# EAGLE design V0p2_Main_PCB2 (EAGLE 6.5.0)
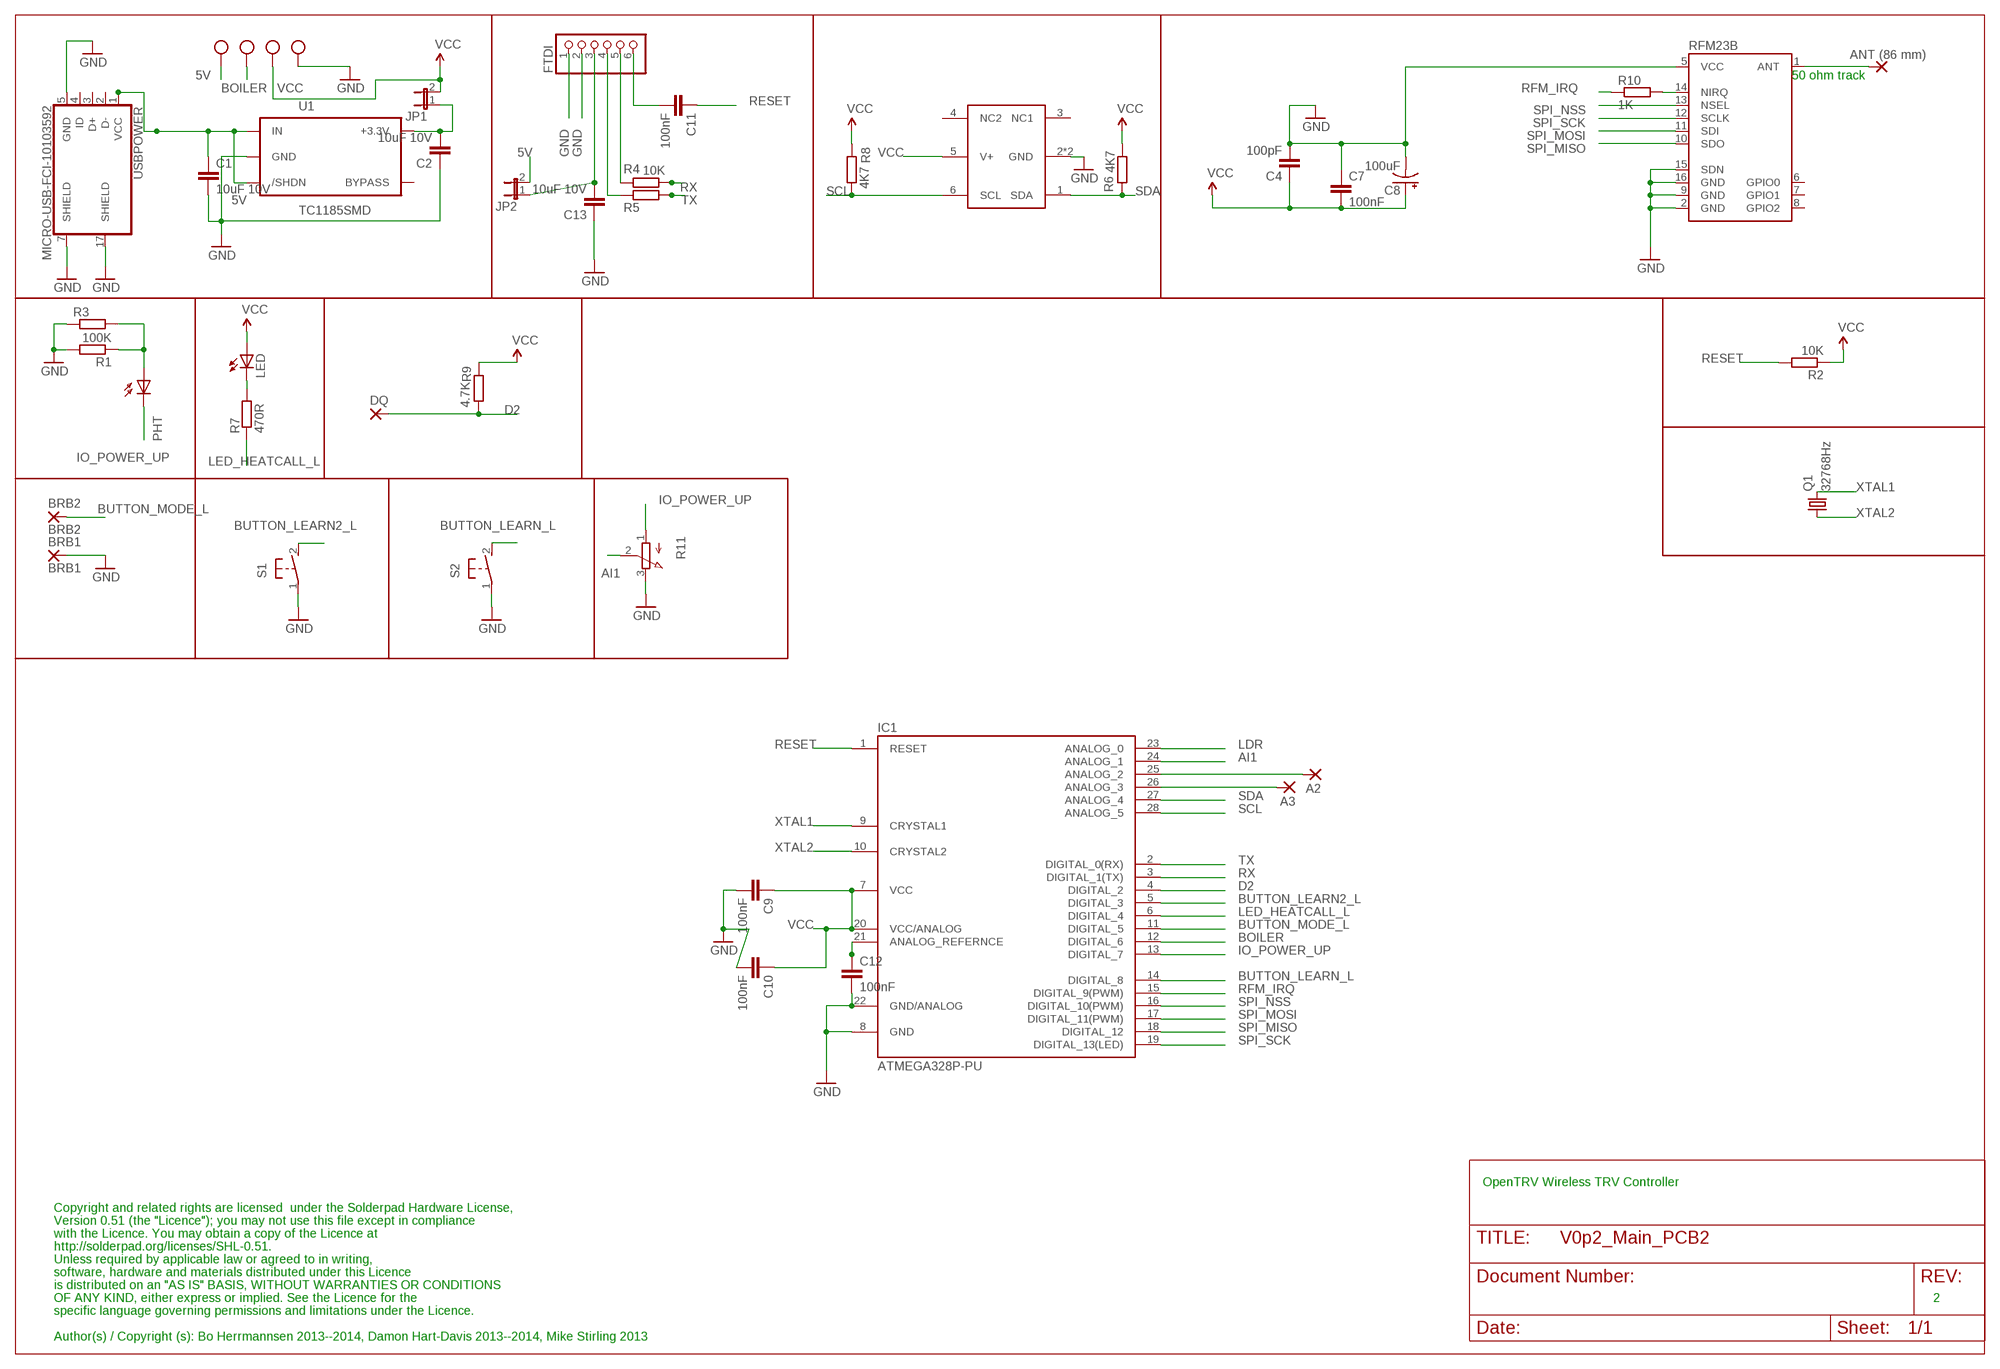
[diagram p0: schematic, sheet 1]

## Parts
A2  2,15/1,0  [2,15/1,0]
A3  2,15/1,0  [2,15/1,0]
ANT1  ANT (86 mm)  2,15/1,0  [2,15/1,0]
BRB1  BRB1  2,15/1,0  [2,15/1,0]
BRB2  BRB2  2,15/1,0  [2,15/1,0]
C1  10uF 10V  C-EUC0603  [C0603]
C2  10uF 10V  C-EUC0603  [C0603]
C4  100pF  C-EUC0603  [C0603]
C7  100nF  C-EUC0603  [C0603]
C8  100uF  CAP_POL1206  [EIA3216]
C9  100nF  C-EUC0603  [C0603]
C10  100nF  C-EUC0603  [C0603]
C11  100nF  C-EUC0603  [C0603]
C12  100nF  C-EUC0603  [C0603]
C13  10uF 10V  C-EUC0603  [C0603]
DQ  2,15/1,0  [2,15/1,0]
FTDI  PINHD-1X6/90  [1X06/90]
IC1  ATMEGA328P-PU  ATMEGA8-PU  [DIL28-3]
JP1  JP1E  [JP1]
JP2  JP1E  [JP1]
LED  LED3MM  [LED3MM]
PHT  BPX65  [BPX65]
Q1  32768Hz  MC-306  [MC-306]
R1  100K  R-EU_R0603  [R0603]
R2  10K  R-EU_R0603  [R0603]
R3  R-EU_0309/V  [0309V]
R4  10K  R-EU_R0603  [R0603]
R5  10K  R-EU_R0603  [R0603]
R6  4K7  R-EU_R0603  [R0603]
R7  470R  R-EU_R0603  [R0603]
R8  4K7  R-EU_R0603  [R0603]
R9  4.7K  R-EU_R0603  [R0603]
R10  1K  R-EU_R0603  [R0603]
R11  EVUE2A  [EVUE]
RFM23B  RFM23B  [RFM23-XXX-S1]
S1  31-XX  [B3F-31XX]
S2  31-XX  [B3F-31XX]
U1  TC1185SMD  [TC1185]
U$4  SHT21  [SHT21]
USBPOWER  MICRO-USB-FCI-10103592  [MICRO-USB-FCI-10103592]
X1  W237-102  [SCREWTERMINAL]
X2  W237-102  [SCREWTERMINAL]

## Nets
5V [supply]: C1.1 JP2.2 U1.1(IN) U1.3(/SHDN) USBPOWER.1(VCC) X1.2
AI1: IC1.24(ANALOG_1) R11.2(S)
BOILER: IC1.12(DIGITAL_6) X1.1
BUTTON_LEARN2_L: IC1.5(DIGITAL_3) S1.2(S)
BUTTON_LEARN_L: IC1.14(DIGITAL_8) S2.2(S)
BUTTON_MODE_L: BRB2.1(P) IC1.11(DIGITAL_5)
D2: DQ.1(P) IC1.4(DIGITAL_2) R9.1
GND [supply]: BRB1.1(P) C1.2 C2.1 C4.2 C7.1 C8.C(-) C9.2 C10.2 C12.2 C13.1 FTDI.1 FTDI.2 IC1.8(GND) IC1.22(GND/ANALOG) R1.2 R3.1 R11.3(E) RFM23B.2(GND) RFM23B.5(VCC) RFM23B.9(GND) RFM23B.15(SDN) RFM23B.16(GND) S1.1(P) S2.1(P) U1.2(GND) U$4.2(GND) U$4.P$1(GND) USBPOWER.5(GND) USBPOWER.7(SHIELD) USBPOWER.17(SHIELD) X2.2
IO_POWER_UP [supply]: IC1.13(DIGITAL_7) PHT.K(C) R11.1(A)
LDR: IC1.23(ANALOG_0) PHT.A R1.1 R3.2
LED_HEATCALL_L: IC1.6(DIGITAL_4) R7.1
N$1: C11.2 FTDI.6
N$3: FTDI.4 R5.2
N$5: FTDI.5 R4.2
N$6 [supply]: C12.1 IC1.21(ANALOG_REFERNCE)
N$7: R10.2 RFM23B.14(NIRQ)
N$8 [supply]: C2.2 JP1.1 U1.5(+3.3V)
N$11 [supply]: C13.2 FTDI.3 JP2.1
N$13: LED.K(C) R7.2
N$24: A2.1(P) IC1.25(ANALOG_2)
N$25: A3.1(P) IC1.26(ANALOG_3)
N$31 [ant]: ANT1.1(P) RFM23B.1(ANT)
RESET: C11.1 IC1.1(RESET) R2.2
RFM_IRQ: IC1.15(DIGITAL_9(PWM)) R10.1
RX: IC1.3(DIGITAL_1(TX)) R4.1
SCL: IC1.28(ANALOG_5) R8.1 U$4.6(SCL)
SDA: IC1.27(ANALOG_4) R6.2 U$4.1(SDA)
SPI_MISO: IC1.18(DIGITAL_12) RFM23B.10(SDO)
SPI_MOSI: IC1.17(DIGITAL_11(PWM)) RFM23B.11(SDI)
SPI_NSS: IC1.16(DIGITAL_10(PWM)) RFM23B.13(NSEL)
SPI_SCK: IC1.19(DIGITAL_13(LED)) RFM23B.12(SCLK)
TX: IC1.2(DIGITAL_0(RX)) R5.1
VCC [supply]: C4.1 C7.2 C8.A(+) C9.1 C10.1 IC1.7(VCC) IC1.20(VCC/ANALOG) JP1.2 LED.A R2.1 R6.1 R8.2 R9.2 U$4.5(V+) X2.1
XTAL1: IC1.9(CRYSTAL1) Q1.4
XTAL2: IC1.10(CRYSTAL2) Q1.1
Unconnected: RFM23B.6(GPIO0) RFM23B.7(GPIO1) RFM23B.8(GPIO2) U1.4(BYPASS) U$4.3(NC1) U$4.4(NC2) USBPOWER.2(D-) USBPOWER.3(D+) USBPOWER.4(ID)

## Notes on the sheet
- 50 ohm track
- OpenTRV Wireless TRV Controller
- Copyright and related rights are licensed  under the Solderpad Hardware License,
- Version 0.51 (the "Licence"); you may not use this file except in compliance
- with the Licence. You may obtain a copy of the Licence at
- http://solderpad.org/licenses/SHL-0.51.
- Unless required by applicable law or agreed to in writing,
- software, hardware and materials distributed under this Licence
- is distributed on an "AS IS" BASIS, WITHOUT WARRANTIES OR CONDITIONS
- OF ANY KIND, either express or implied. See the Licence for the | 2
- specific language governing permissions and limitations under the Licence.
- Author(s) / Copyright (s): Bo Herrmannsen 2013--2014, Damon Hart-Davis 2013--2014, Mike Stirling 2013

## Library data of the parts
A2 A3 ANT1 BRB1 BRB2 DQ = wirepad:2,15/1,0: THROUGH-HOLE PAD
C1 C2 C4 C7 C9-C13 = resistor:C-EU: CAPACITOR, European symbol
C8 = SparkFun-Passives:CAP_POL: Capacitor Polarized These are standard SMD and PTH capacitors. Normally 10uF, 47uF, and 100uF in electrolytic and tantalum varieties. Always verify the external diameter of the through hole cap, it varies with capacity, voltage, and manufacturer. The EIA devices should be standard.
FTDI = pinhead:PINHD-1X6: PIN HEADER
IC1 = Arduino-AVR:ATMEGA8-PU
JP1 JP2 = jumper:JP1E: JUMPER
LED = adafruit:LED: LED OSRAM: - CHIPLED LG R971, LG N971, LY N971, LG Q971, LY Q971, LO R971, LY R971 LH N974, LH R974 LS Q976, LO Q976, LY Q976 LO Q996 - Hyper CHIPLED LW Q18S LB Q993, LB Q99A, LB R99A - SideLED LS A670, LO A670, LY A670, LG A670, LP A670 LB A673, LV A673, LT A673, LW A673 LH A674 LY A675 LS A676, LA A676, LO A676, LY A676, LW A676 LS A679, LY A679, LG A679 - Hyper Micro SIDELED® LS Y876, LA Y876, LO Y876, LY Y876 LT Y87S - SmartLED LW L88C, LW L88S LB L89C, LB L89S, LG L890 LS L89K, LO L89K, LY L89K LS L896, LA L896, LO L896, LY L896 - TOPLED LS T670, LO T670, LY T670, LG T670, LP T670 LSG T670, LSP T670, LSY T670, LOP T670, LYG T670 LG T671, LOG T671, LSG T671 LB T673, LV T673, LT T673, LW T673 LH T674 LS T676, LA T676, LO T676, LY T676, LB T676, LH T676, LSB T676, LW T676 LB T67C, LV T67C, LT T67C, LS T67K, LO T67K, LY T67K, LW E67C LS E67B, LA E67B, LO E67B, LY E67B, LB E67C, LV E67C, LT E67C LW T67C LS T679, LY T679, LG T679 LS T770, LO T770, LY T770, LG T770, LP T770 LB T773, LV T773, LT T773, LW T773 LH T774 LS E675, LA E675, LY E675, LS T675 LS T776, LA T776, LO T776, LY T776, LB T776 LHGB T686 LT T68C, LB T68C - Hyper Mini TOPLED® LB M676 - Mini TOPLED Santana® LG M470 LS M47K, LO M47K, LY M47K Source: http://www.osram.convergy.de/
PHT = opto-trans-siemens:BPX65: PHOTO DIODE; MPN: BPX65.; OC_FARNELL: 327451; OC_NEWARK: 06WX2764
Q1 = crystal:MC-306: kHz RANGE CRYSTAL UNIT SMD Source: MC-306_405_406_E07X.PDF Homepage <http://www.epsontoyocom.co.jp>; MPN: MC-306 60.0KHZ 100PPM ,12.5PF; OC_FARNELL: 1278040; OC_NEWARK: 31M5576
R1-R10 = resistor:R-EU_: RESISTOR, European symbol
R11 = pot:EVU: 9 mm Square Rotary Potentiometers Source: Panasonic
RFM23B = SparkFun-RF:RFM23B
S1 S2 = adafruit:31-XX: OMRON SWITCH Now with beefier pads!
U1 = 3.3VREG:TC1185
U$4 = SHT21:SHT21: Tempsensor RS No: 709-8868 MRF No: TMP112AIDRLT
USBPOWER = micro-usb-fci-10103592:MICRO-USB-FCI-10103592: Micro USB B Connector RS No: 714-2334 MRF No: 10103592-0001LF
X1 X2 = screwterminal:W237-102: Screw terminal 3.5mm Pitch RS No: 710-0444 MRF No:1776275-2; MPN: 237-102; OC_FARNELL: unknown; OC_NEWARK: 70K9898

## Net classes
0 default: width 0.203 mm
1 supply: width 0.406 mm, clearance 0.203 mm
2 ant: width 2.184 mm

## Board
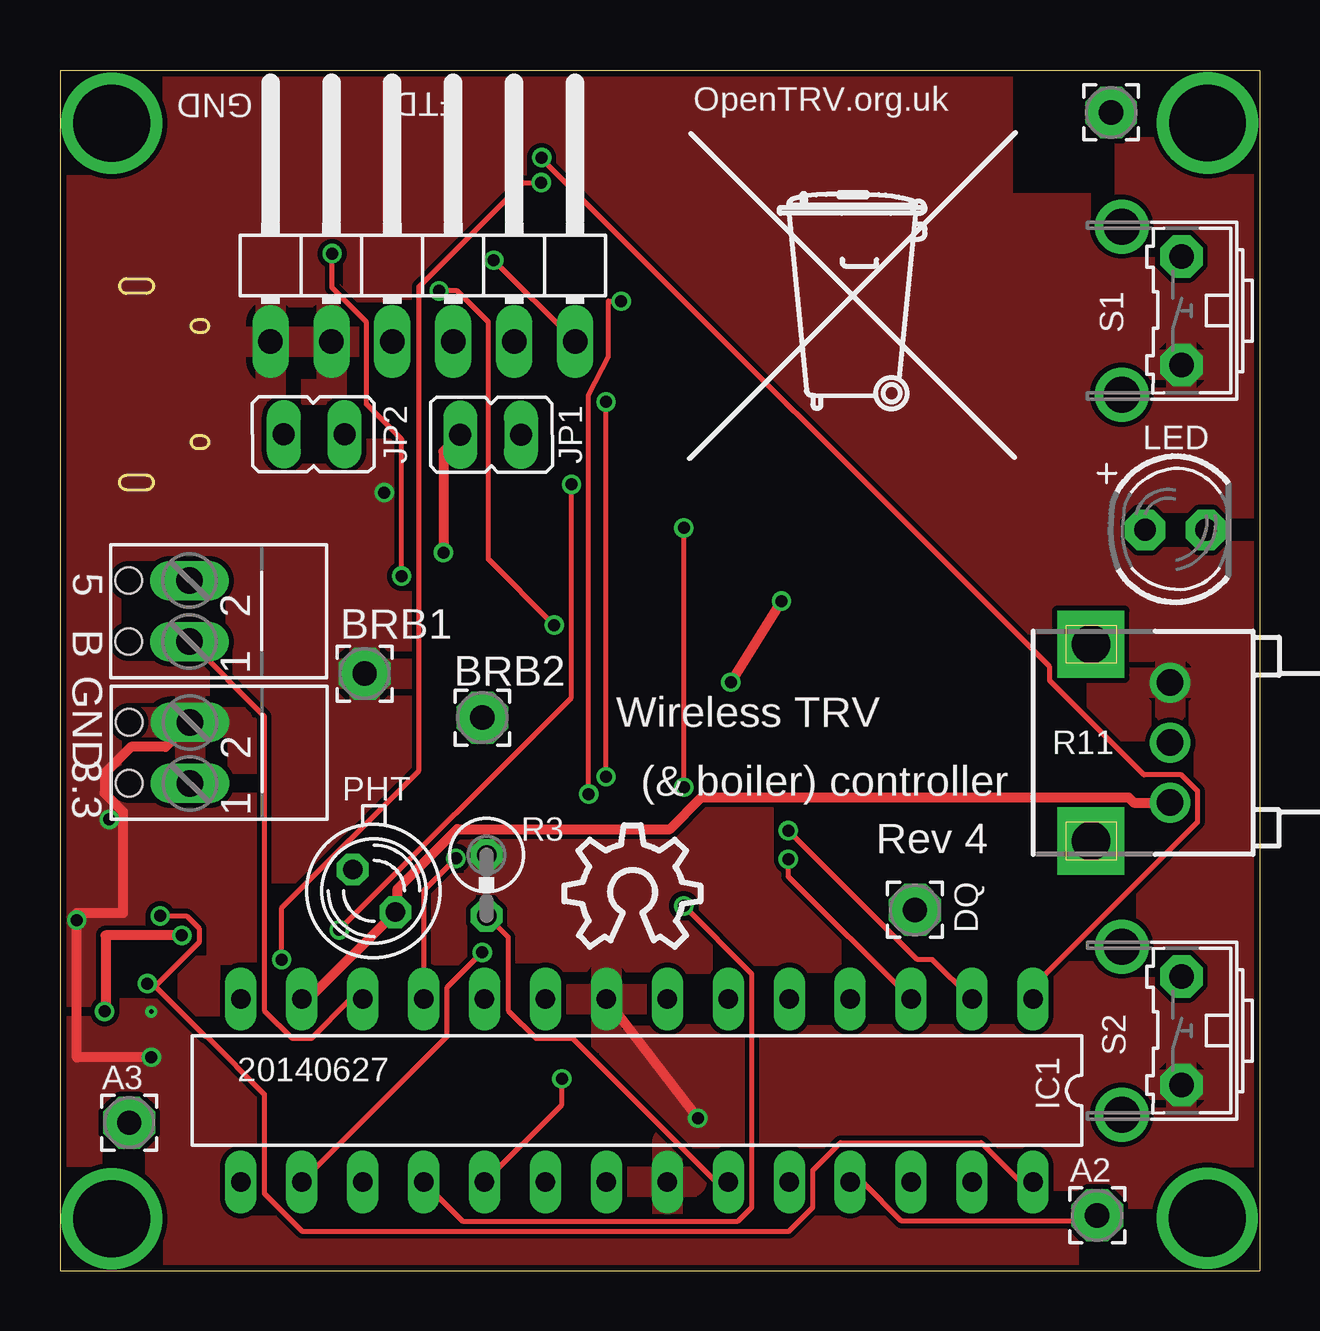
[diagram p1: board, top side]
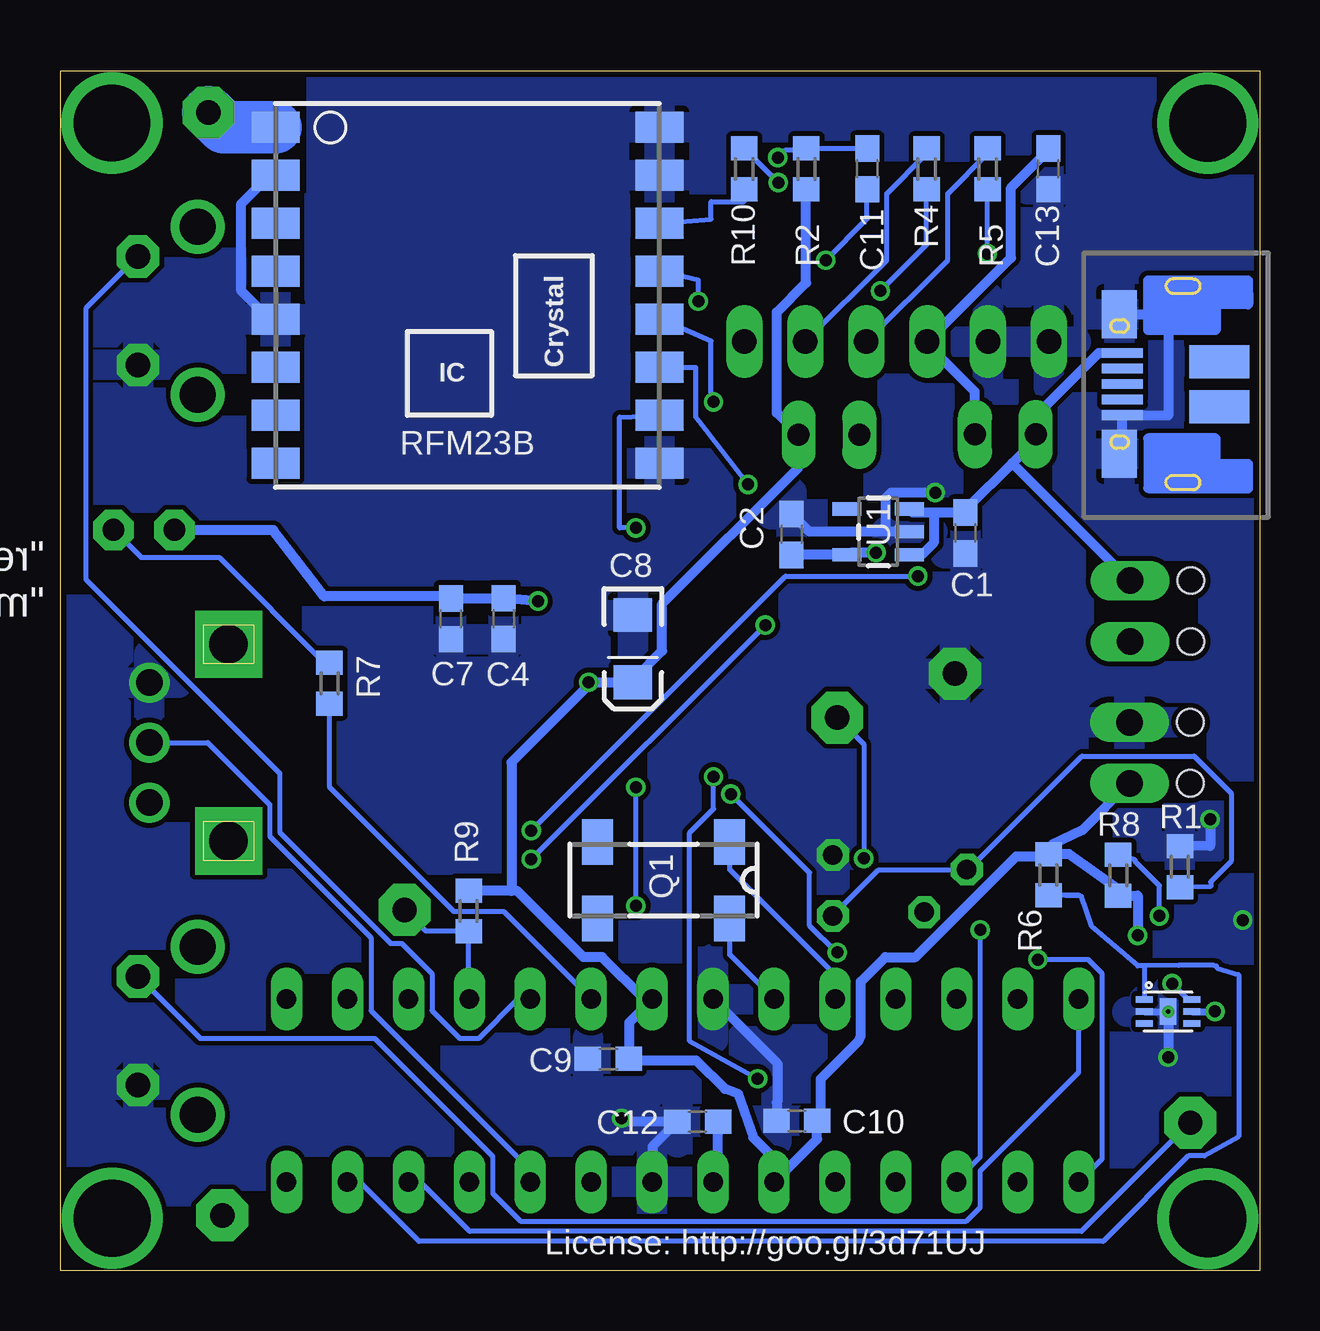
[diagram p2: board, bottom side, seen from below]

Size 50 x 50 mm. Coordinates in mm from the lower left corner, seen from the top.
Outline: 0,0 50,0 50,50 0,50 0,0
Copper layers (1*16): Top 0.035mm / dielectric 1.5mm / Bottom 0.035mm
Design rules "PMServicesStd *": minimum track width 8mil, minimum drill 0.5mm, track to track 8mil, track to pad 8mil, pad to pad 8mil, via to via 8mil, smd to smd 0mil, copper to edge 10mil, drill to drill 10mil, minimum pad ring 10mil, minimum via ring 6mil, stop-mask expansion 2mil, vias tented up to drill 100mil, thermal gap 10mil

### Footprints (pad centres in the part's own frame; a part is rotated, then mirrored left to right if it is on the bottom)
2,15/1,0 = drill 1.016 pad 2.159 octagon: 1 0,0
C0603 = smd 1.1 x 1: 1 -0.85,0; 2 0.85,0
EIA3216 = smd 1.4 x 1.6: A 1.4,0; C -1.4,0
1X06/90 = drill 1.016 long: 1 -6.35,-3.81; 2 -3.81,-3.81; 3 -1.27,-3.81; 4 1.27,-3.81; 5 3.81,-3.81; 6 6.35,-3.81
DIL28-3 = drill 0.813 long: 1 -16.51,-3.81; 2 -13.97,-3.81; 3 -11.43,-3.81; 4 -8.89,-3.81; 5 -6.35,-3.81; 6 -3.81,-3.81; 7 -1.27,-3.81; 8 1.27,-3.81; 9 3.81,-3.81; 10 6.35,-3.81; 11 8.89,-3.81; 12 11.43,-3.81; 13 13.97,-3.81; 14 16.51,-3.81; 15 16.51,3.81; 16 13.97,3.81; 17 11.43,3.81; 18 8.89,3.81; 19 6.35,3.81; 20 3.81,3.81; 21 1.27,3.81; 22 -1.27,3.81; 23 -3.81,3.81; 24 -6.35,3.81; 25 -8.89,3.81; 26 -11.43,3.81; 27 -13.97,3.81; 28 -16.51,3.81
JP1 = drill 0.914 long: 1 0,-1.27; 2 0,1.27
LED3MM = drill 0.914 pad 1.676 octagon: A -1.27,0; K 1.27,0
BPX65 = drill 0.813 octagon: A -0.889,-0.889; K 0.889,0.889
MC-306 = smd 1.3 x 1.9: 1 -2.75,-1.6; 2 2.75,-1.6; 3 2.75,1.6; 4 -2.75,1.6
R0603 = smd 1 x 1.1: 1 -0.85,0; 2 0.85,0
0309V = drill 0.813 octagon: 1 -1.27,0; 2 1.27,0
EVUE = drill 1.1 pad 1.676: 1 0,-2.5; 2 0,0; 3 0,2.5 | drill 1.6 pad 2.8 square: M1 -3.3,4.1; M2 -3.3,-4.1
RFM23-XXX-S1 = smd 2 x 1.3: 1 -8,7; 2 -8,5; 3 -8,3; 4 -8,1; 5 -8,-1; 6 -8,-3; 7 -8,-5; 8 -8,-7; 9 8,-7; 10 8,-5; 11 8,-3; 12 8,-1; 13 8,1; 14 8,3; 15 8,5; 16 8,7
B3F-31XX = drill 1.016 pad 1.778 octagon: 1 -2.261,-1.245; 2 2.261,-1.245 | drill 1.499 pad 2.032: 3 -3.505,1.245; 4 3.505,1.245
TC1185 = smd 0.55 x 1.2: 1 -0.95,-1.3; 2 0,-1.3; 3 0.95,-1.3; 4 0.95,1.3; 5 -0.95,1.3
SHT21 = smd 0.28 x 0.7: 1 -0.5,-0.988; 2 0,-0.988; 3 0.5,-0.988; 4 0.5,0.988; 5 0,0.988; 6 -0.5,0.988 | smd 1.1 x 0.7: P$1 0,0
MICRO-USB-FCI-10103592 = smd 0.4 x 1.71: 1 3.84,2.51; 2 3.19,2.51; 3 2.54,2.51; 4 1.89,2.51; 5 1.24,2.51 | smd 2 x 1.46: 7 -0.36,2.64; 17 5.44,2.64 | smd 1.375 x 2.5: 11 1.603,-1.52; 12 3.478,-1.52
SCREWTERMINAL = drill 1.1 long: 1 -1.27,-1.27; 2 1.27,-1.27 | hole 1.1: -1.27,1.27; 1.27,1.27

### Placement (x,y rotation side)
A2  43.23,2.31 0 top
A3  2.89,6.17 0 top
ANT1  43.81,48.26 0 top
BRB1  12.7,24.87 0 top
BRB2  17.6,23.04 180 top
C1  12.27,30.74 270 bottom
C2  19.51,30.68 270 bottom
C4  31.51,27.17 270 bottom
C7  33.7,27.16 90 bottom
C8  26.12,25.92 270 bottom
C9  27.15,8.82 180 bottom
C10  19.28,6.24 180 bottom
C11  16.35,45.91 270 bottom
C12  23.42,6.21 180 bottom
C13  8.8,45.91 90 bottom
DQ  35.64,15.03 0 top
FTDI  15.12,42.52 0 top
IC1  24.05,7.51 180 top
JP1  17.95,34.83 270 top
JP2  10.59,34.85 90 top
LED  46.5,30.86 0 top
PHT  13.09,15.82 270 top
Q1  24.84,16.27 180 bottom
R1  3.32,16.83 90 bottom
R2  18.89,45.91 90 bottom
R3  17.78,16.05 270 top
R4  13.87,45.91 90 bottom
R5  11.33,45.91 90 bottom
R6  8.79,16.49 270 bottom
R7  38.77,24.47 90 bottom
R8  5.89,16.47 270 bottom
R9  32.96,14.99 90 bottom
R10  21.48,45.91 270 bottom
R11  46.27,22 0 top
RFM23B  33.02,40.64 0 bottom
S1  45.5,40 90 top
S2  45.5,10 90 top
U1  15.89,30.79 90 bottom
U$1  [OSHW_10X200_NOTEXT]  21.02,13.49 0 top
U$2  [TONNE]  32.88,37.88 0 top
U$4  3.81,10.79 270 bottom
USBPOWER  3.2,34.4 90 bottom
X1  4.13,27.48 90 top
X2  4.15,21.57 90 top

### Tracks (layer width: path | path; a pad name or v marks a point on that pad's centre or on a via)
5V
  Bottom 0.406: 13.58,31.6 14.46,31.6 14.58,31.72 U1.3 | 13.58,31.6 C1.1 12.18,31.78 10.31,33.65 | 13.58,31.6 13.58,30.34 14.08,29.84 U1.1 | USBPOWER.1 6.7,38.24 9.32,35.62 JP2.2 9.32,34.64 10.31,33.65 | 10.31,33.65 5.42,28.76 X1.2
AI1
  Bottom 0.203: R11.2 43.84,22 41.26,19.42 41.26,18.1 37.04,13.88 37.04,10.84 30.4,4.2 IC1.24
BOILER
  Top 0.203: IC1.12 12.6,11.3 12.1,11.3 10.48,9.68 9.68,9.68 8.52,10.84 8.52,23.1 5.42,26.2 X1.1
BUTTON_LEARN2_L
  Bottom 0.203: IC1.5 30.4,11.3 30.92,11.3 32.54,9.68 33.34,9.68 34.5,10.84 34.5,12.38 35.76,13.64 36.22,13.64 40.84,18.26 40.84,20.72 48.92,28.8 48.92,40.1 46.76,42.26 S1.2
BUTTON_LEARN_L
  Bottom 0.203: IC1.14 7.54,11.3 7.54,8.26 11.64,4.16 11.64,2.64 12.22,2.06 30.8,2.06 31.96,3.22 31.96,4.76 36.88,9.68 44.16,9.68 S2.2
BUTTON_MODE_L  (via drill 0.5)
  Top 0.203: v16.5,17.18 15.16,15.84 IC1.11
  Bottom 0.203: v16.5,17.18 16.5,21.94 BRB2.1
D2
  Bottom 0.203: IC1.4 32.96,11.34 32.96,14.12 R9.1 33.06,14.16 34.76,14.16 35.62,15.02 DQ.1
GND  (via drill 0.2, 0.5)
  Top 0.406: 2.62,18.8 2.62,19.14 1.86,19.9 1.86,20.72 2.96,21.82 4.4,21.82 X2.2 | 2.62,18.8 2.62,14.9 0.7,14.9 v0.7,14.61 0.7,8.89 v3.81,8.89 | 2.62,18.8 v2.06,18.8 | v26.59,6.35 IC1.8
  Bottom 0.29: U$4.2 U$4.P$1
  Bottom 0.406: 15.6,30.8 18.78,30.8 C2.1 | 15.6,30.8 U1.2 | USBPOWER.7 5.84,34.06 5.72,34.18 USBPOWER.5 3.81,35.63 3.81,39.84 USBPOWER.17 | IC1.22 25.3,3.7 25.3,5.18 C12.2 26.67,6.21 26.67,6.35 v26.59,6.35 | RFM23B.5 41.22,39.6 42.44,40.82 42.44,44.46 41.34,45.56 41.22,45.56 RFM23B.2 41.02,45.72 | 15.6,30.8 15.6,32.18 15.36,32.42 v13.52,32.42 | RFM23B.9 25.64,33.51 RFM23B.9 | RFM23B.9 25.64,33.48 RFM23B.9 | v2.06,18.8 2.06,17.7 R1.2 | C10.2 20.12,7 20.1,7.02 20.1,8.64 22.76,11.3 IC1.8 | U$4.P$1 v3.81,8.89
  other vias: 3.81,10.79
  pour Bottom: 0,0 50,0 50,50 44.6,50 44.6,44.28 39.09,44.27 39.09,50 0,50
  pour Top: 0,50 0,0 50,0 50,50 44.6,50 44.6,44.28 39.09,44.27 39.09,50
IO_POWER_UP
  Top 0.406: IC1.13 10.36,11.32 13.96,14.92 PHT.K 14.08,15.12 14.08,15.92 16.56,18.4 25.42,18.4 26.74,19.72 44.54,19.72 44.76,19.5 R11.1
LDR
  Top 0.203: IC1.23 27.84,3.7 27.34,3.7 21.36,9.68 19.84,9.68 18.68,10.84 18.68,13.9 17.8,14.78 R3.2
  Bottom 0.203: R3.2 17.78,14.8 15.88,16.7 PHT.A 12.1,16.74 7.4,21.44 2.72,21.44 1.18,19.9 1.18,17.06 2.04,16.2 2.04,16 R1.1
LED_HEATCALL_L
  Bottom 0.203: R7.1 38.76,20.14 33.58,14.96 31.5,14.96 IC1.6
N$1  (via drill 0.5)
  Top 0.203: v18.08,42.1 FTDI.6
  Bottom 0.203: v18.08,42.1 16.36,43.82 16.36,45.04 C11.2
N$3
  Bottom 0.203: R5.2 11.34,46.74 11.34,46.54 13,44.88 13,42.1 FTDI.4
N$4  (via drill 3.2)
  other vias: 2.16,47.81
N$5
  Bottom 0.203: R4.2 13.88,46.74 13.88,46.54 15.54,44.88 15.54,42.1 FTDI.5
N$6
  Bottom 0.406: C12.1 22.58,3.88 22.76,3.7 IC1.21
N$7
  Bottom 0.203: R10.2 21.48,45.04 21.48,44.54 22.86,44.54 22.86,43.81 24.91,43.65 RFM23B.14
N$8  (via drill 0.5)
  Top 0.406: v15.98,29.92 15.98,34.14 16.66,34.82 JP1.1
  Bottom 0.406: C2.2 U1.5 17,29.92 v15.98,29.92
N$11
  Bottom 0.406: C13.2 8.8,46.74 8.8,46.68 10.36,45.12 10.36,42.2 FTDI.3 13.76,38.52 11.88,36.64 11.88,34.86 JP2.1
N$12  (via drill 3.2)
  other vias: 47.83,2.19
N$13
  Bottom 0.203: R7.2 38.78,25.34 38.98,25.34 43.36,29.72 46.62,29.72 LED.K
N$19  (via drill 3.2)
  other vias: 47.83,47.82
N$22  (via drill 3.2)
  other vias: 2.16,2.16
N$24
  Top 0.203: IC1.25 32.94,3.68 33.46,3.68 35.08,2.06 42.98,2.06 A2.1
N$25
  Bottom 0.203: IC1.26 35.46,3.68 34.96,3.68 32.92,1.64 7.42,1.64 A3.1
N$31
  Bottom 2.184: RFM23B.1 43.18,47.64 ANT1.1
RESET  (via drill 0.5)
  Top 0.203: v20.08,46.38 20.08,46.34 41.26,25.16 41.26,24.58 45.18,20.66 46.74,20.66 47.42,19.98 47.42,18.7 40.56,11.84 IC1.1
  Bottom 0.203: 18.88,46.74 R2.2 | v20.08,46.38 19.76,46.7 18.98,46.7 R2.2 | C11.1 18.78,46.76 R2.2
RFM_IRQ  (via drill 0.5)
  Top 0.203: v20.06,45.34 19.3,45.34 14.96,41 14.96,20.84 9.24,15.12 v9.24,12.96
  Bottom 0.203: v20.06,45.34 21.46,46.74 R10.1 | v9.24,12.96 7.14,12.96 6.56,12.38 6.56,4.66 7.52,3.7 IC1.15
RX  (via drill 0.5)
  Top 0.203: v15.8,40.82 16.56,40.82 17.86,39.52 17.86,29.64 v20.6,26.9 | v30.36,17.14 30.36,16.42 35.46,11.32 IC1.3
  Bottom 0.203: v15.8,40.82 13.88,42.74 13.88,45.04 R4.1 | v30.36,17.14 v20.6,26.9
SCL  (via drill 0.5)
  Top 0.203: IC1.28 40.54,3.7 40.04,3.7 38.4,5.34 32.54,5.34 31.38,4.18 31.38,2.64 30.38,1.64 10.1,1.64 8.52,3.22 8.52,7.36 6.16,9.72 6.06,9.76 3.86,11.96 v3.64,11.96 4.04,11.92 5.8,13.68 5.8,14.26 5.28,14.78 v4.17,14.78
  Bottom 0.203: v3.64,11.96 2.98,11.3 2.84,11.3 U$4.6 | v4.17,14.78 4.17,16.04 5.2,17.06 5.2,17.12 R8.1
SDA
  Bottom 0.203: 7.51,15.64 R6.2 7.42,15.6 6.99,14.33 5.08,12.7 4.8,12.7 | IC1.27 38,3.68 37.5,3.68 35.04,1.22 6.52,1.22 2.96,4.78 2.3,4.78 0.86,5.58 0.86,12.34 1.76,12.6 1.8,12.7 1.9,12.72 3.38,12.72 4.8,12.7 | U$4.1 4.8,12.62 4.8,12.7
SPI_MISO  (via drill 0.5)
  Top 0.203: v26,20.14 v26,30.95 | v26,15.2 28.84,12.36 28.84,2.64 28.26,2.06 16.78,2.06 15.16,3.68 IC1.18
  Bottom 0.203: v26,30.95 26.67,30.95 26.67,35.56 25.14,35.62 25.04,35.62 RFM23B.10 | v26,15.2 v26,20.14
SPI_MOSI  (via drill 0.5)
  Top 0.203: v21.32,32.76 21.32,23.88 v11.64,14.2
  Bottom 0.203: v21.32,32.76 23.5,35.56 23.5,37.62 25.02,37.62 RFM23B.11 | v11.64,14.2 11.64,4.74 12.6,3.78 12.6,3.7 IC1.17
SPI_NSS  (via drill 0.5)
  Top 0.203: v23.39,40.4 22.86,40.4 22.86,38.1 22.04,36.5 v22.04,19.86 | v17.6,13.26 16.14,11.8 16.14,9.76 IC1.16
  Bottom 0.203: v23.39,40.4 23.39,41.27 24.91,41.62 25.02,41.62 RFM23B.13 | v22.04,19.86 18.76,16.58 18.76,14.38 17.64,13.26 v17.6,13.26
SPI_SCK  (via drill 0.5)
  Top 0.203: v22.76,20.58 v22.76,36.2 | v20.92,8 20.92,6.92 IC1.19
  Bottom 0.203: v22.76,36.2 22.86,36.2 22.86,38.73 24.91,39.62 25.02,39.62 RFM23B.12 | v22.76,20.58 22.76,19.24 23.76,18.24 23.76,9.56 v20.92,8
TX  (via drill 0.5)
  Top 0.203: v11.34,42.38 11.34,40.96 12.78,39.52 12.78,36.1 14.24,34.64 v14.24,28.94 | v30.36,18.34 35.74,12.96 36.36,12.96 38,11.32 IC1.2
  Bottom 0.203: v11.34,42.38 11.34,45.04 R5.1 | v14.24,28.94 19.76,28.94 v30.36,18.34
VCC  (via drill 0.5)
  Top 0.406: v30.07,27.9 v27.96,24.52 | v5.08,13.97 1.91,13.97 1.91,10.8 | 1.91,10.8 1.91,10.79 | v1.86,10.8 1.91,10.8
  Bottom 0.29: U$4.5 1.91,10.79
  Bottom 0.406: 31.18,15.82 30.94,15.82 28.18,13.06 27.4,13.06 25.62,11.28 IC1.7 25.32,11.3 26.28,10.34 26.28,8.84 C9.1 26.08,8.76 23.48,8.76 22.29,7.57 21.73,7.37 21.1,5.54 19.88,4.32 IC1.20 20.22,3.7 18.44,5.48 18.44,6.22 C10.1 18.3,6.4 18.3,7.98 16.7,9.58 16.62,9.78 16.62,12.04 15.6,13.06 14.34,13.06 10.14,17.26 8.98,17.26 R6.1 | 31.18,15.82 32.96,15.82 R9.2 | R2.1 18.9,45.04 18.9,41.16 20.12,39.94 20.12,35.74 JP1.2 19.26,34.62 19.26,33.42 24.9,27.78 24.9,25.82 26.02,24.7 C8.A 26.14,24.52 v27.96,24.52 28.04,24.32 31.18,21.18 31.18,15.82 | v30.07,27.9 C4.1 C7.2 33.9,28.1 38.98,28.1 41.1,30.86 LED.A | 5.76,15.8 7.93,17.36 R6.1 | 5.76,15.8 5.7,15.76 | R6.1 8.65,17.74 7.38,18.36 5.44,20.3 X2.1 | v5.08,13.97 5.08,15.62 R8.2 5.88,15.64 5.76,15.8 | v1.86,10.8 1.91,10.79
XTAL1
  Bottom 0.203: Q1.4 22.08,13.16 IC1.9
XTAL2
  Bottom 0.203: Q1.1 22.08,16.7 17.7,12.32 IC1.10

### Text on the board
bPlace: License: http://goo.gl/3d71UJ
tNames: GND | OpenTRV.org.uk | 5 | B | GND | Wireless TRV | 3.3 | (& boiler) controller | Rev 4 | 20140627
bNames: "replace milling with slot drilling if rqd" / "min 2.1mm x 1.8mm"